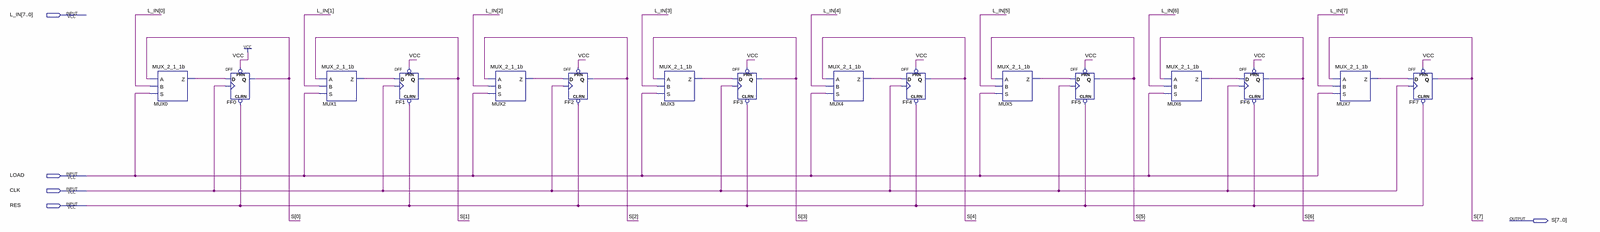
[diagram p0: schematic sheet, whole]
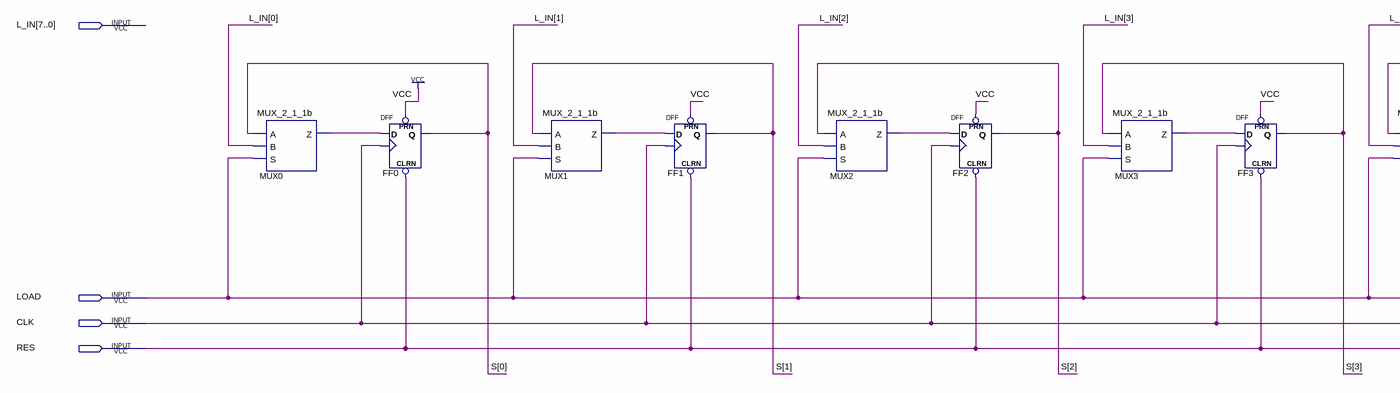
[diagram p1: schematic sheet, left part]
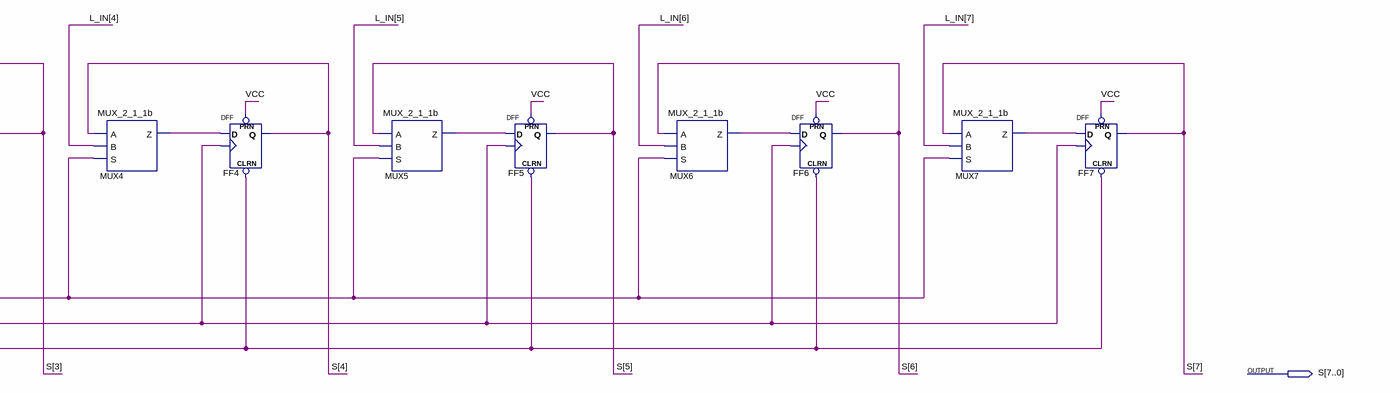
[diagram p2: schematic sheet, right part]
// Quartus schematic REG_8b.bdf as structural Verilog: 16 symbols, 5 pins
module REG_8b (
  input  [7:0] L_IN,
  input  LOAD,
  input  CLK,
  input  RES,
  output [7:0] S
);

  wire MUX0_z, MUX1_z, MUX2_z, MUX3_z, MUX4_z, MUX5_z, MUX6_z, MUX7_z;

  MUX_2_1_1b MUX0 (.A(S[0]), .B(L_IN[0]), .S(LOAD), .Z(MUX0_z));
  DFF FF0 (.CLRN(RES), .CLK(CLK), .D(MUX0_z), .PRN(1'b1), .Q(S[0]));
  MUX_2_1_1b MUX1 (.A(S[1]), .B(L_IN[1]), .S(LOAD), .Z(MUX1_z));
  DFF FF1 (.CLRN(RES), .CLK(CLK), .D(MUX1_z), .PRN(1'b1), .Q(S[1]));
  MUX_2_1_1b MUX2 (.A(S[2]), .B(L_IN[2]), .S(LOAD), .Z(MUX2_z));
  DFF FF2 (.CLRN(RES), .CLK(CLK), .D(MUX2_z), .PRN(1'b1), .Q(S[2]));
  MUX_2_1_1b MUX3 (.A(S[3]), .B(L_IN[3]), .S(LOAD), .Z(MUX3_z));
  DFF FF3 (.CLRN(RES), .CLK(CLK), .D(MUX3_z), .PRN(1'b1), .Q(S[3]));
  MUX_2_1_1b MUX4 (.A(S[4]), .B(L_IN[4]), .S(LOAD), .Z(MUX4_z));
  DFF FF4 (.CLRN(RES), .CLK(CLK), .D(MUX4_z), .PRN(1'b1), .Q(S[4]));
  MUX_2_1_1b MUX5 (.A(S[5]), .B(L_IN[5]), .S(LOAD), .Z(MUX5_z));
  DFF FF5 (.CLRN(RES), .CLK(CLK), .D(MUX5_z), .PRN(1'b1), .Q(S[5]));
  MUX_2_1_1b MUX6 (.A(S[6]), .B(L_IN[6]), .S(LOAD), .Z(MUX6_z));
  DFF FF6 (.CLRN(RES), .CLK(CLK), .D(MUX6_z), .PRN(1'b1), .Q(S[6]));
  MUX_2_1_1b MUX7 (.A(S[7]), .B(L_IN[7]), .S(LOAD), .Z(MUX7_z));
  DFF FF7 (.CLRN(RES), .CLK(CLK), .D(MUX7_z), .PRN(1'b1), .Q(S[7]));
endmodule
